# EasyEDA Pro project ProPrj_两相交错电源demo_2025-05-26.epro, schematic lm5143
Board Name: Board3; Create Date: 2025-04-17; Page Name: P1; Project Name: 两相交错电源demo; Schematic Name: lm5143; Update Date: 2025-04-29; Company: 嘉立创EDA; Page Size: A4; Version: V1.0
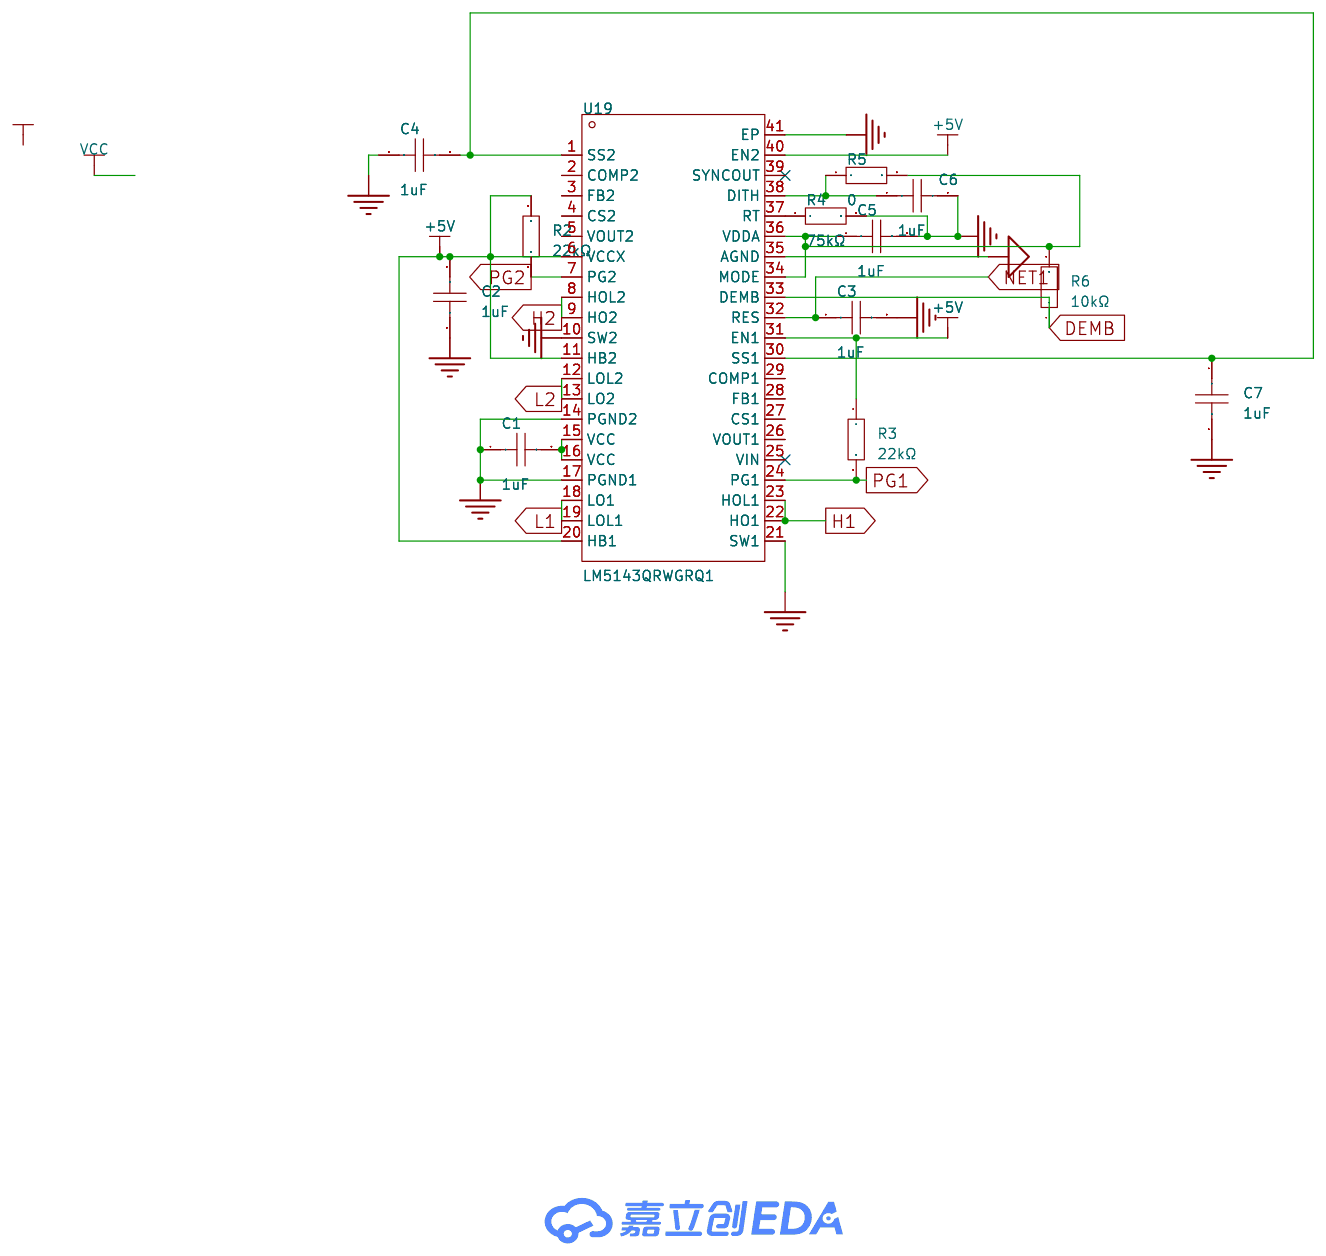
[diagram p0: schematic sheet]

## Parts
C1  1uF  [C0603]
C2  1uF  [C0603]
C3  1uF  [C0603]
C4  1uF  [C0603]
C5  1uF  [C0603]
C6  1uF  [C0603]
C7  1uF  [C0603]
R2  22kΩ  [R0603]
R3  22kΩ  [R0603]
R4  75kΩ  [R0603]
R5  0  [R0603]
R6  10kΩ  [R0603]
U19  LM5143QRWGRQ1  [VQFN-40_L6.0-W6.0-P0.50-TL-EP3.3]

## Library data of the parts
C1-C7 = CL10A105KB8NNNC: 容值:1uF;精度:±10%;额定电压:50V;材质(温度系数):X5R;; LCSC Part Name: 1uF ±10% 50V; Supplier Part: C15849; Manufacturer: SAMSUNG(三星); Supplier Footprint: 0603; JLCPCB Part Class: 基础库; Datasheet: https://atta.szlcsc.com/upload/public/pdf/source/20160218/1457707763339.pdf; Supplier: LCSC; Tolerance: ±10%; Voltage Rated: 50V; Temperature Coefficient: X5R
R2-R6 = 0603WAF7502T5E: 电阻类型:厚膜电阻;阻值:75kΩ;精度:±1%;功率:100mW;最大工作电压:75V;温度系数:±100ppm/℃;; LCSC Part Name: 75kΩ ±1% 100mW 厚膜电阻; Supplier Part: C23242; Manufacturer: UNI-ROYAL(厚声); Supplier Footprint: 0603; JLCPCB Part Class: 基础库; Datasheet: https://atta.szlcsc.com/upload/public/pdf/source/20200306/C422600_1E6D84923E4A46A82E41ADD87F860B5C.pdf; Supplier: LCSC; Type: 厚膜电阻; Tolerance: ±1%; Power(Watts): 100mW; Overload Voltage (Max): 75V; Temperature Coefficient: ±100ppm/℃; Operating Temperature Range: -55℃~+155℃
U19 = LM5143QRWGRQ1: 功能类型:降压型;工作电压:3.5V~65V;输出电流:-;; LCSC Part Name: 具有低IQ的汽车类3.5V至65V双路同步降压控制器; Supplier Part: C1849541; Manufacturer: TI(德州仪器); Supplier Footprint: VQFN-40-EP(6x6); JLCPCB Part Class: 扩展库; Datasheet: https://www.ti.com/cn/lit/gpn/lm5143-q1; Supplier: LCSC; Function: 降压型; Input Voltage: 3.5V~65V; Switching Frequency: 2.2MHz; Operating Temperature: -40℃~+150℃@(TJ); Synchronous Rectification: 是; Number of Outputs: 2; Topology: 降压式; Switch tube (built-in/external): 外置

## Nets
+5V: C2.1 R2.1 R3.1 U19.6(VCCX) U19.11(HB2) U19.20(HB1) U19.31(EN1) U19.40(EN2)
AGND: U19.35(AGND)
GND: C1.1 C2.2 C3.2 C4.1 C5.2 C6.2 C7.2 R4.2 U19.10(SW2) U19.14(PGND2) U19.17(PGND1) U19.21(SW1) U19.41(EP)
DEMB: R6.1 U19.33(DEMB)
H1: U19.22(HO1) U19.23(HOL1)
H2: U19.8(HOL2) U19.9(HO2)
L1: U19.18(LO1) U19.19(LOL1)
L2: U19.12(LOL2) U19.13(LO2)
NET1: C3.1 U19.32(RES)
PG1: R3.2 U19.24(PG1)
PG2: R2.2 U19.7(PG2)
Net-(C1-2): C1.2 U19.15(VCC) U19.16(VCC)
Net-(C4-2): C4.2 C7.1 U19.1(SS2) U19.30(SS1)
Net-(C5-1): C5.1 R5.2 R6.2 U19.34(MODE) U19.36(VDDA)
Net-(C6-1): C6.1 R5.1 U19.38(DITH)
Net-(R4-1): R4.1 U19.37(RT)

Not connected (* = marked no-connect by the designer): U19 2(COMP2) 3(FB2) 4(CS2) 5(VOUT2) 25(VIN)* 26(VOUT1) 27(CS1) 28(FB1) 29(COMP1) 39(SYNCOUT)*
